# Altium schematic sheet ADC Buffering.SchDoc
size A4; SheetNumber: 2; SheetTotal: 3
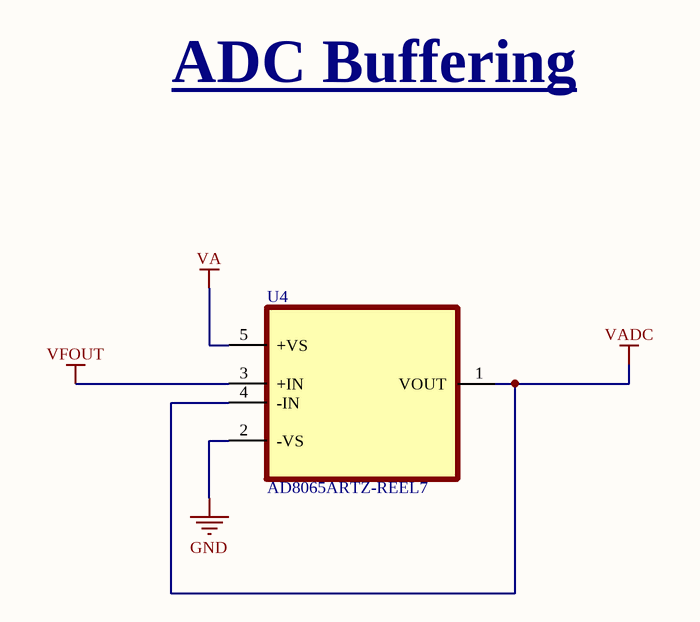
[diagram p0: ADC Buffering.SchDoc]

## Parts
U4  AD8065ARTZ-REEL7  [SOT95P290X145-5N]

## Nets
GND: U4.2(-VS)
VA: U4.5(+VS)
VADC: U4.1(VOUT) U4.4(-IN)
VFOUT: U4.3(+IN)

## Notes on the sheet
- ADC Buffering

## Library data of the parts
U4 = AD8065ARTZ-REEL7: Voltage Feedback Amplifier 1 Circuit Rail-to-Rail SOT-23-5; MF: Analog Devices; Price: None; Package: SOT-23-5 Analog Devices; Value: AD8065ARTZ-REEL7; MP: AD8065ARTZ-REEL7; DigiKey-Purchase-URL: https://snapeda.com/shop?store=DigiKey&id=385700; SnapEDA_Link: https://www.snapeda.com/parts/AD8065ARTZ-REEL7/Analog%20Devices%20Inc./view-part/385700/?ref=snap; Availability: Unavailable